# EAGLE design qcopter_fea_bb (EAGLE 7.5.0)
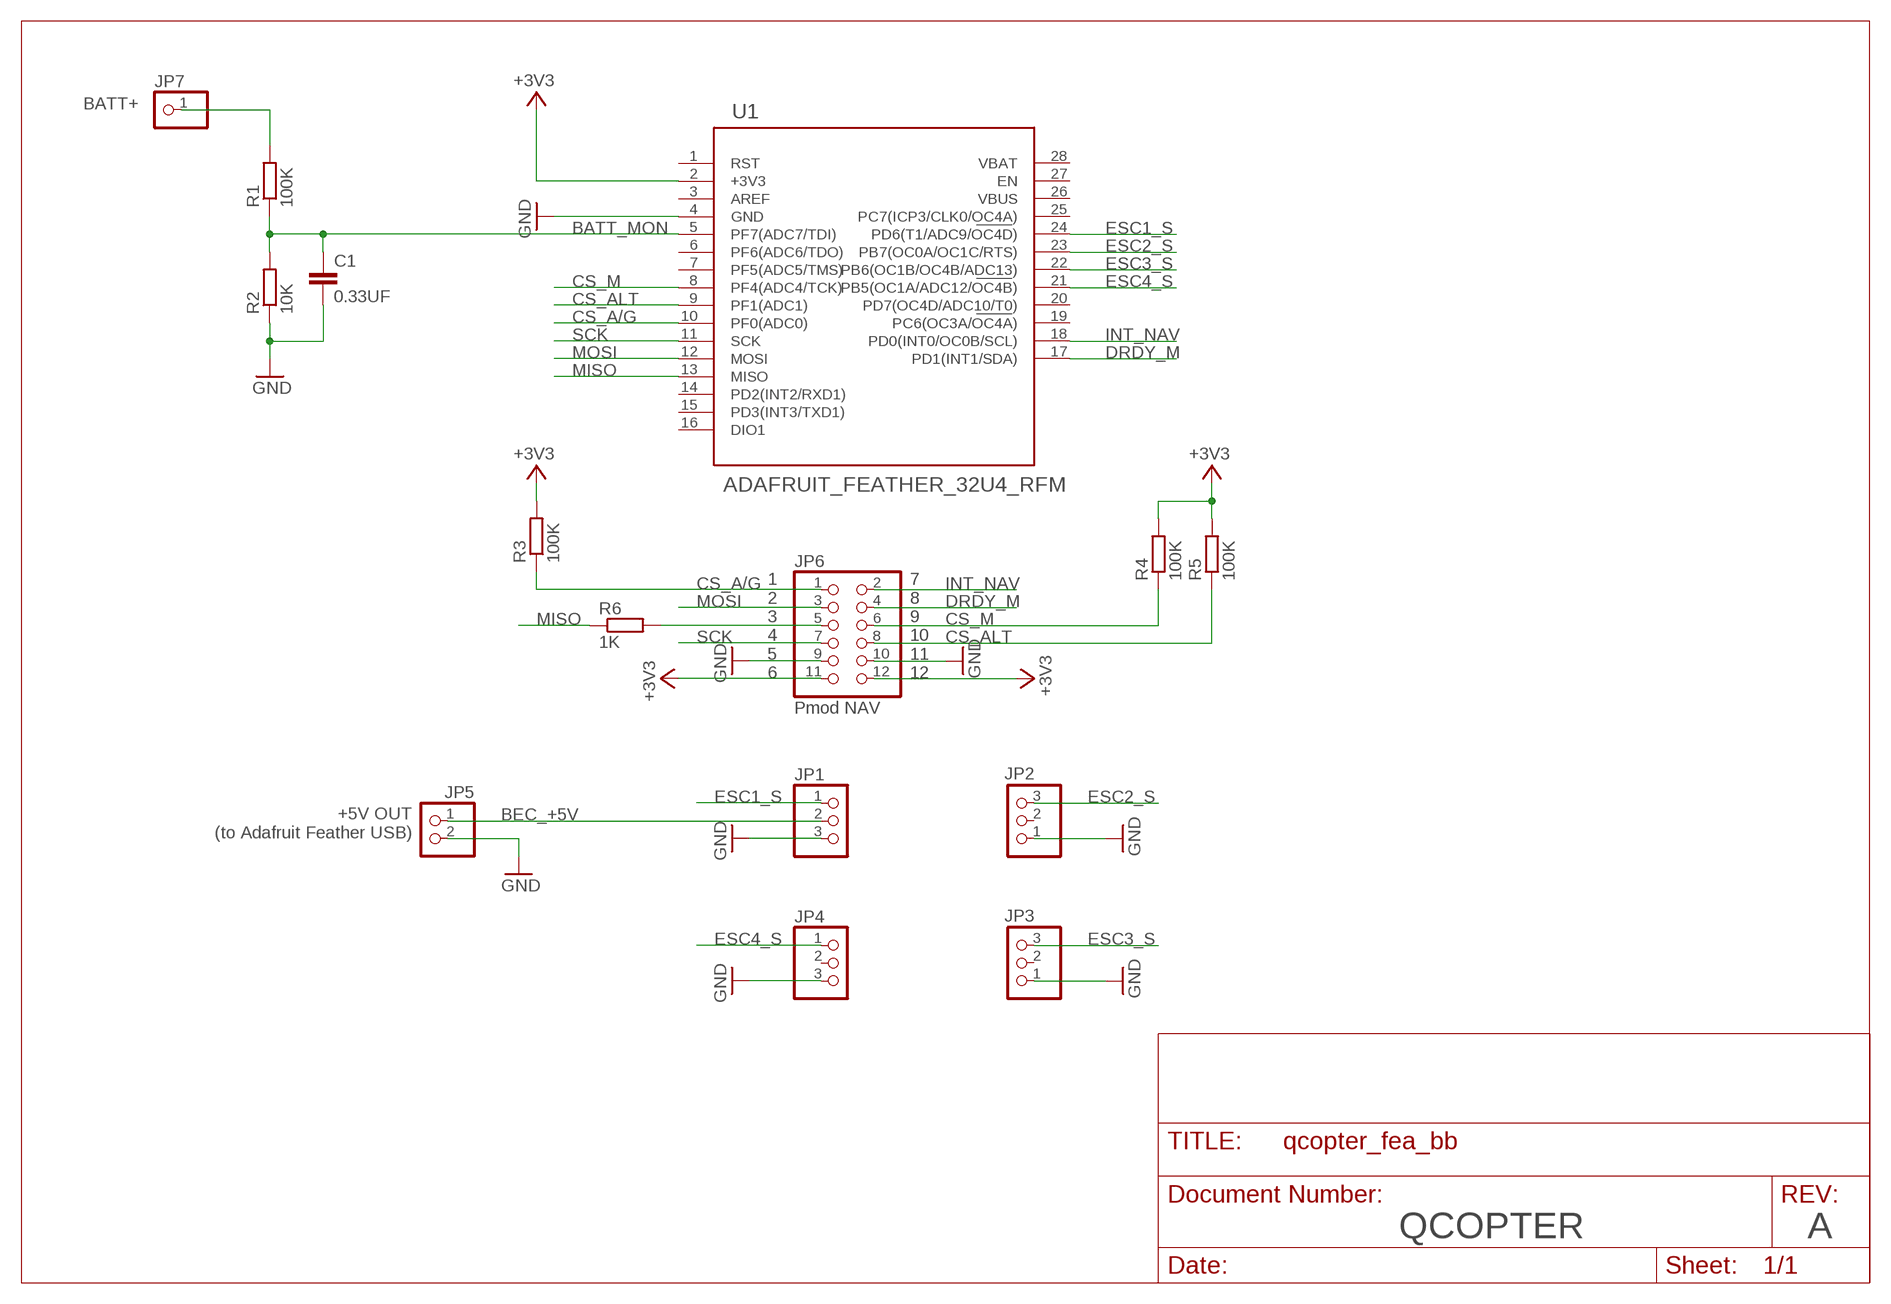
[diagram p0: schematic, sheet 1]

## Parts
C1  0.33UF  C-EU025-025X050  [C025-025X050]
JP1  PINHD-1X3/90  [1X03/90]
JP2  PINHD-1X3/90  [1X03/90]
JP3  PINHD-1X3/90  [1X03/90]
JP4  PINHD-1X3/90  [1X03/90]
JP5  PINHD-1X2/90  [1X02/90]
JP6  Pmod NAV  PINHD-2X6/90  [2X06/90]
JP7  PINHD-1X1  [1X01]
R1  100K  R-EU_0207/10  [0207/10]
R2  10K  R-EU_0207/10  [0207/10]
R3  100K  R-EU_0207/10  [0207/10]
R4  100K  R-EU_0207/10  [0207/10]
R5  100K  R-EU_0207/10  [0207/10]
R6  1K  R-EU_0207/10  [0207/10]
U1  ADAFRUIT_FEATHER_32U4_RFM  [ADAFRUIT_FEATHER_32U4_RFM]

## Nets
+3V3: JP6.11 JP6.12 R3.2 R4.2 R5.2 U1.2(+3V3)
BATT+: JP7.1 R1.2
BATT_MON: C1.1 R1.1 R2.2 U1.5(PF7(ADC7/TDI))
BEC_+5V: JP1.2 JP5.1
CS_A/G: JP6.1 R3.1 U1.10(PF0(ADC0))
CS_ALT: JP6.8 R5.1 U1.9(PF1(ADC1))
CS_M: JP6.6 R4.1 U1.8(PF4(ADC4/TCK))
DRDY_M: JP6.4 U1.17(PD1(INT1/SDA))
ESC1_S: JP1.1 U1.24(PD6(T1/ADC9/OC4D))
ESC2_S: JP2.3 U1.23(PB7(OC0A/OC1C/RTS))
ESC3_S: JP3.3 U1.22(PB6(OC1B/OC4B/ADC13))
ESC4_S: JP4.1 U1.21(PB5(OC1A/ADC12/OC4B))
GND: C1.2 JP1.3 JP2.1 JP3.1 JP4.3 JP5.2 JP6.9 JP6.10 R2.1 U1.4(GND)
INT_NAV: JP6.2 U1.18(PD0(INT0/OC0B/SCL))
MISO: R6.1 U1.13(MISO)
MOSI: JP6.3 U1.12(MOSI)
N$1: JP6.5 R6.2
SCK: JP6.7 U1.11(SCK)
Unconnected: JP2.2 JP3.2 JP4.2 U1.1(RST) U1.3(AREF) U1.6(PF6(ADC6/TDO)) U1.7(PF5(ADC5/TMS)) U1.14(PD2(INT2/RXD1)) U1.15(PD3(INT3/TXD1)) U1.16(DIO1) U1.19(PC6(OC3A/OC4A)) U1.20(PD7(OC4D/ADC10/T0)) U1.25(PC7(ICP3/CLK0/OC4A)) U1.26(VBUS) U1.27(EN) U1.28(VBAT)

## Notes on the sheet
- 1
  2
  3
  4
  5
  6
- 7
  8
  9
  10
  11
  12
- +5V OUT
  (to Adafruit Feather USB)
- QCOPTER | A

## Library data of the parts
C1 = resistor:C-EU: CAPACITOR, European symbol
JP1-JP4 = pinhead:PINHD-1X3: PIN HEADER
JP5 = pinhead:PINHD-1X2: PIN HEADER
JP6 = pinhead:PINHD-2X6: PIN HEADER
JP7 = pinhead:PINHD-1X1: PIN HEADER
R1-R6 = resistor:R-EU_: RESISTOR, European symbol
U1 = Adafruit Feather 32u4 RFM:ADAFRUIT_FEATHER_32U4_RFM: Adafruit Feather 32u4 RFM95 LoRa Radio - 868 or 915 MHz

## Board
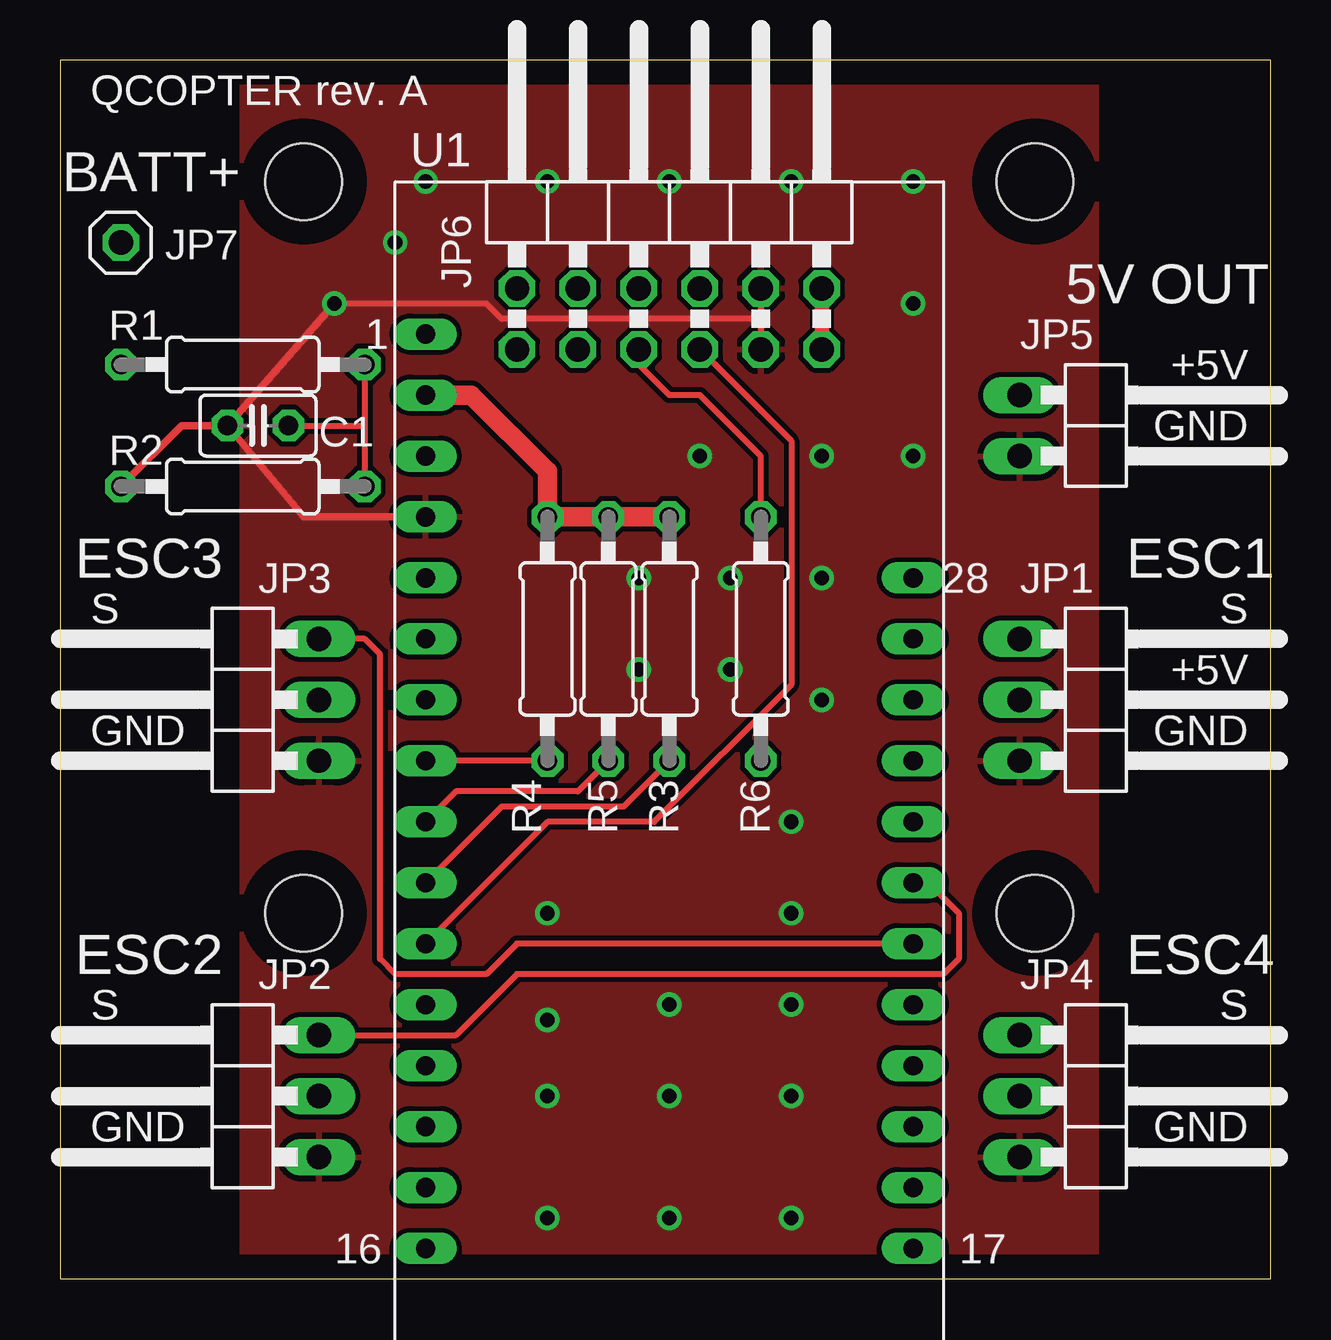
[diagram p1: board, top side]
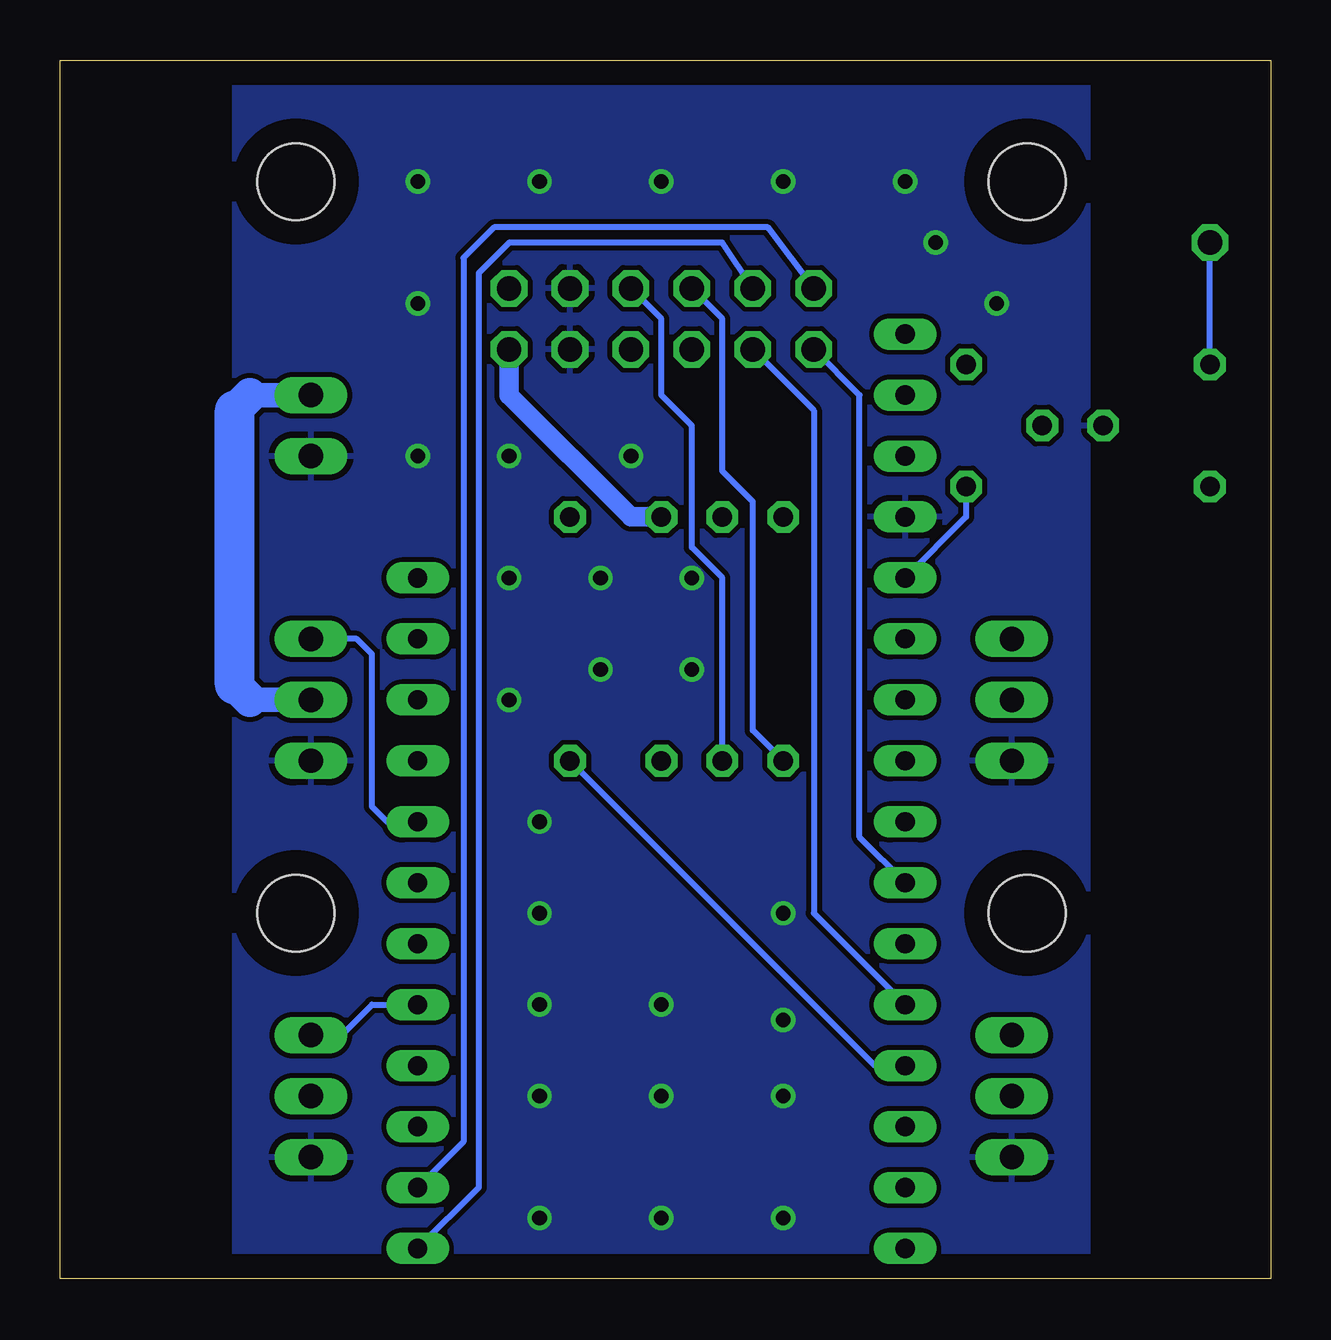
[diagram p2: board, bottom side, seen from below]

Size 50.47 x 50.79 mm. Coordinates in mm from the lower left corner, seen from the top.
Outline: 0,0 50.47,0 50.47,50.79 0,50.79 0,0
Copper layers (1*16): Top 0.035mm / dielectric 1.5mm / Bottom 0.035mm
Design rules "default": minimum track width 10mil, minimum drill 24mil, track to track 8mil, track to pad 8mil, pad to pad 8mil, via to via 8mil, smd to smd 8mil, copper to edge 40mil, drill to drill 8mil, minimum pad ring 10mil, minimum via ring 8mil, stop-mask expansion 4mil, vias tented up to drill 0mil, thermal gap 10mil
Holes 3.2 mm at 10.16,45.72 40.64,45.72 10.16,15.24 40.64,15.24

### Footprints (pad centres in the part's own frame; a part is rotated, then mirrored left to right if it is on the bottom)
C025-025X050 = drill 0.813 octagon: 1 -1.27,0; 2 1.27,0
1X03/90 = drill 1.016 long: 1 -2.54,-3.81; 2 0,-3.81; 3 2.54,-3.81
1X02/90 = drill 1.016 long: 1 -1.27,-3.81; 2 1.27,-3.81
2X06/90 = drill 1.016 octagon: 1 -6.35,-6.35; 2 -6.35,-3.81; 3 -3.81,-6.35; 4 -3.81,-3.81; 5 -1.27,-6.35; 6 -1.27,-3.81; 7 1.27,-6.35; 8 1.27,-3.81; 9 3.81,-6.35; 10 3.81,-3.81; 11 6.35,-6.35; 12 6.35,-3.81
1X01 = drill 1.016 octagon: 1 0,0
0207/10 = drill 0.813 octagon: 1 -5.08,0; 2 5.08,0
ADAFRUIT_FEATHER_32U4_RFM = drill 0.8 long: 1 -10.16,20.32; 2 -10.16,17.78; 3 -10.16,15.24; 4 -10.16,12.7; 5 -10.16,10.16; 6 -10.16,7.62; 7 -10.16,5.08; 8 -10.16,2.54; 9 -10.16,0; 10 -10.16,-2.54; 11 -10.16,-5.08; 12 -10.16,-7.62; 13 -10.16,-10.16; 14 -10.16,-12.7; 15 -10.16,-15.24; 16 -10.16,-17.78; 17 10.16,-17.78; 18 10.16,-15.24; 19 10.16,-12.7; 20 10.16,-10.16; 21 10.16,-7.62; 22 10.16,-5.08; 23 10.16,-2.54; 24 10.16,0; 25 10.16,2.54; 26 10.16,5.08; 27 10.16,7.62; 28 10.16,10.16

### Placement (x,y rotation side)
C1  8.26,35.56 180 top
JP1  43.81,24.13 270 top
JP2  6.99,7.62 90 top
JP3  6.99,24.13 90 top
JP4  43.81,7.62 270 top
JP5  43.81,35.56 270 top
JP6  25.4,45.09 0 top
JP7  2.54,43.18 0 top
R1  7.62,38.1 180 top
R2  7.62,33.02 0 top
R3  25.4,26.67 90 top
R4  20.32,26.67 90 top
R5  22.86,26.67 90 top
R6  29.21,26.67 90 top
U1  25.4,19.05 0 top

### Tracks (layer width: path | path; a pad name or v marks a point on that pad's centre or on a via)
+3V3
  Top 0.61: JP6.12 JP6.11
  Top 0.813: R3.2 R5.2 R4.2 20.32,33.66 17.14,36.83 U1.2
  Bottom 0.813: JP6.11 31.75,36.83 26.67,31.75 R3.2
BATT+
  Bottom 0.254: R1.2 JP7.1
BATT_MON
  Top 0.254: R1.1 12.7,35.56 | 12.7,35.56 R2.2 | C1.1 12.7,35.56
  Bottom 0.254: U1.5 12.7,31.75 R2.2
BEC_+5V
  Bottom 1.016: JP1.2 42.55,24.13 | 42.55,36.83 JP5.1
  Bottom 1.422: 42.55,24.13 43.18,24.77 | 43.18,36.2 42.55,36.83
  Bottom 1.676: 43.18,24.77 43.18,36.2
CS_A/G
  Top 0.254: U1.10 18.41,19.68 23.5,19.68 R3.1
  Bottom 0.254: JP6.1 17.14,36.83 17.14,18.41 U1.10
CS_ALT
  Top 0.254: U1.9 16.51,20.32 21.59,20.32 R5.1
  Bottom 0.254: R5.1 22.86,29.21 24.13,30.48 24.13,35.56 25.4,36.83 25.4,40.01 JP6.8
CS_M
  Top 0.254: R4.1 U1.8
  Bottom 0.254: JP6.6 22.86,40.01 22.86,33.66 21.59,32.38 21.59,22.86 R4.1
DRDY_M
  Bottom 0.254: U1.17 33.02,3.81 33.02,41.91 31.75,43.18 22.86,43.18 JP6.4
ESC1_S
  Bottom 0.254: U1.24 36.83,19.05 37.47,19.68 37.47,26.04 38.1,26.67 JP1.1
ESC2_S
  Top 0.254: U1.23 36.2,16.51 37.47,15.24 37.47,13.34 36.83,12.7 19.05,12.7 16.51,10.16 JP2.3
ESC3_S
  Top 0.254: U1.22 19.05,13.97 17.78,12.7 13.97,12.7 13.34,13.34 13.34,26.04 12.7,26.67 JP3.3
ESC4_S
  Bottom 0.254: JP4.1 38.73,10.16 37.47,11.43 U1.21
GND  (via drill 0.61 pad 0.25)
  Top 0.254: JP6.10 29.21,40.01 | 29.21,40.01 JP6.9 | v11.43,40.64 17.78,40.64 18.41,40.01 29.21,40.01
  Top 0.305: R2.1 5.08,35.56 C1.2 | U1.4 10.16,31.75 C1.2 | v11.43,40.64 C1.2
  other vias: 20.32,2.54 25.4,2.54 30.48,2.54 30.48,7.62 25.4,7.62 20.32,7.62 30.48,11.43 25.4,11.43 30.48,19.05 20.32,15.24 27.94,25.4 24.13,25.4 24.13,29.21 27.94,29.21 31.75,24.13 31.75,29.21 31.75,34.29 26.67,34.29 13.97,43.18 35.56,45.72 35.56,40.64 35.56,34.29 30.48,45.72 25.4,45.72 20.32,45.72 15.24,45.72 20.32,10.79 30.48,15.24
  pour Bottom: 7.62,0 7.62,50.8 43.18,50.8 43.18,0
  pour Top: 7.62,0 7.62,50.8 43.18,50.8 43.18,0
INT_NAV
  Bottom 0.254: U1.18 33.66,5.71 33.66,42.55 32.38,43.81 20.95,43.81 JP6.2
MISO
  Bottom 0.254: U1.13 16.51,8.89 R6.1
MOSI
  Bottom 0.254: U1.12 19.05,15.24 19.05,36.2 JP6.3
N$1
  Top 0.254: R6.2 29.21,34.29 26.67,36.83 25.4,36.83 24.13,38.1 JP6.5
SCK
  Top 0.254: U1.11 20.32,19.05 24.77,19.05 30.48,24.77 30.48,34.92 29.21,36.2 JP6.7

### Text on the board
tNames: QCOPTER rev. A | BATT+ | 5V OUT | 1 | +5V / GND | 28 | ESC3 | ESC1 | S / / GND | S / +5V / GND | ESC2 | ESC4 | S / / GND | S / / GND | 16 | 17